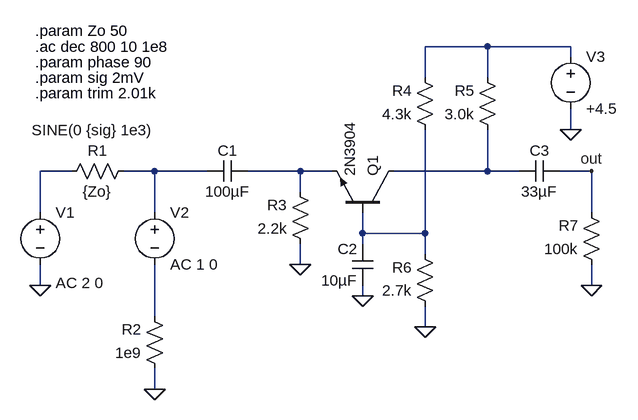
[diagram p0: schematic ECE521_50ohmAFamp.asc]
ECE521_50ohmAFamp.asc, the LTspice schematic file:
Version 4
SHEET 1 1028 680
WIRE 736 -48 640 -48
WIRE 864 -48 736 -48
WIRE 864 -32 864 -48
WIRE 640 0 640 -48
WIRE 736 0 736 -48
WIRE 864 80 864 48
WIRE 96 144 48 144
WIRE 224 144 176 144
WIRE 304 144 224 144
WIRE 448 144 368 144
WIRE 496 144 448 144
WIRE 736 144 736 80
WIRE 736 144 592 144
WIRE 784 144 736 144
WIRE 896 144 848 144
WIRE 448 176 448 144
WIRE 48 208 48 144
WIRE 224 208 224 144
WIRE 896 208 896 144
WIRE 544 240 544 208
WIRE 640 240 640 80
WIRE 640 240 544 240
WIRE 544 256 544 240
WIRE 640 272 640 240
WIRE 448 288 448 256
WIRE 48 320 48 288
WIRE 896 320 896 288
WIRE 544 336 544 320
WIRE 224 368 224 288
WIRE 640 384 640 352
WIRE 224 480 224 448
FLAG 48 320 0
FLAG 224 480 0
FLAG 448 288 0
FLAG 544 336 0
FLAG 640 384 0
FLAG 896 320 0
FLAG 864 80 0
FLAG 896 144 out
SYMBOL res 192 128 R90
WINDOW 0 0 56 VBottom 2
WINDOW 3 32 56 VTop 2
SYMATTR InstName R1
SYMATTR Value {Zo}
SYMBOL res 240 464 R180
WINDOW 0 36 76 Left 2
WINDOW 3 36 40 Left 2
SYMATTR InstName R2
SYMATTR Value 1e9
SYMBOL res 464 272 R180
WINDOW 0 36 76 Left 2
WINDOW 3 36 40 Left 2
SYMATTR InstName R3
SYMATTR Value 2.2k
SYMBOL res 656 96 R180
WINDOW 0 36 76 Left 2
WINDOW 3 36 40 Left 2
SYMATTR InstName R4
SYMATTR Value 4.3k
SYMBOL res 752 96 R180
WINDOW 0 36 76 Left 2
WINDOW 3 36 40 Left 2
SYMATTR InstName R5
SYMATTR Value 3.0k
SYMBOL res 656 368 R180
WINDOW 0 36 76 Left 2
WINDOW 3 36 40 Left 2
SYMATTR InstName R6
SYMATTR Value 2.7k
SYMBOL res 912 304 R180
WINDOW 0 36 76 Left 2
WINDOW 3 36 40 Left 2
SYMATTR InstName R7
SYMATTR Value 100k
SYMBOL voltage 48 192 R0
WINDOW 3 -13 -111 Left 2
WINDOW 123 24 124 Left 2
WINDOW 39 0 0 Left 0
SYMATTR InstName V1
SYMATTR Value SINE(0 {sig} 1e3)
SYMATTR Value2 AC 2 0
SYMBOL voltage 224 192 R0
SYMATTR InstName V2
SYMATTR Value AC 1 0
SYMBOL voltage 864 -48 R0
SYMATTR InstName V3
SYMATTR Value +4.5
SYMBOL npn 592 208 M270
SYMATTR InstName Q1
SYMATTR Value 2N3904
SYMBOL cap 368 128 R90
WINDOW 0 0 32 VBottom 2
WINDOW 3 32 32 VTop 2
SYMATTR InstName C1
SYMATTR Value 100µF
SYMBOL cap 560 320 R180
WINDOW 0 24 56 Left 2
WINDOW 3 24 8 Left 2
SYMATTR InstName C2
SYMATTR Value 10µF
SYMBOL cap 784 160 R270
WINDOW 0 32 32 VTop 2
WINDOW 3 0 32 VBottom 2
SYMATTR InstName C3
SYMATTR Value 33µF
TEXT 40 -72 Left 2 !.param Zo 50
TEXT 40 -48 Left 2 !.ac dec 800 10 1e8
TEXT 40 -24 Left 2 !.param phase 90
TEXT 40 0 Left 2 !.param sig 2mV
TEXT 40 24 Left 2 !.param trim 2.01k

The netlist it stands for:
* ECE521_50ohmAFamp.asc
R1 N003 N002 {Zo}
R2 0 N007 1e9
R3 0 N004 2.2k
R4 N006 N001 4.3k
R5 N005 N001 3.0k
R6 0 N006 2.7k
R7 0 out 100k
V1 N002 0 SINE(0 {sig} 1e3) AC 2 0
V2 N003 N007 AC 1 0
V3 N001 0 +4.5
Q1 N005 N006 N004 0 2N3904
C1 N004 N003 100µF
C2 0 N006 10µF
C3 N005 out 33µF
.model NPN NPN
.model PNP PNP
.lib standard.bjt
.param Zo 50
.ac dec 800 10 1e8
.param phase 90
.param sig 2mV
.param trim 2.01k
.backanno
.end